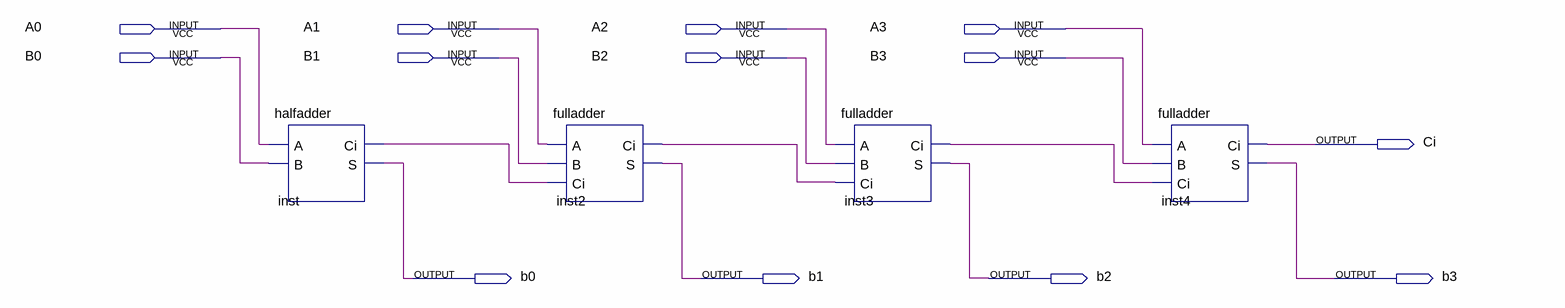
[diagram p0: schematic sheet]
// Quartus schematic 4bitadder.bdf as structural Verilog: 4 symbols, 13 pins
module \4bitadder  (
  input  A0,
  input  A1,
  input  A2,
  input  A3,
  inout  B0,
  inout  B1,
  inout  B2,
  inout  B3,
  output Ci
);

  wire inst2_ci, inst3_ci, inst_ci;

  halfadder inst (.A(A0), .B(B0), .Ci(inst_ci), .S(B0));
  fulladder inst2 (.A(A1), .B(B1), .Ci({inst_ci, inst2_ci}), .S(B1));
  fulladder inst3 (.A(A2), .B(B2), .Ci({inst2_ci, inst3_ci}), .S(B2));
  fulladder inst4 (.A(A3), .B(B3), .Ci({inst3_ci, Ci}), .S(B3));
endmodule
